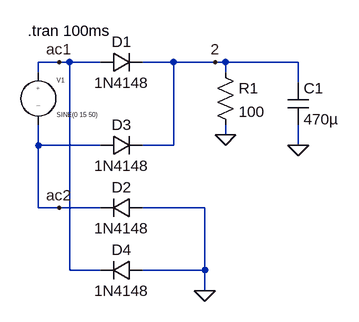
[diagram p0: schematic brueckengleichrichter.asc]
brueckengleichrichter.asc, the LTspice schematic file:
Version 4
SHEET 1 880 680
WIRE 96 112 64 112
WIRE 112 112 96 112
WIRE 160 112 112 112
WIRE 272 112 224 112
WIRE 336 112 272 112
WIRE 352 112 336 112
WIRE 464 112 352 112
WIRE 64 128 64 112
WIRE 352 128 352 112
WIRE 464 144 464 112
WIRE 352 224 352 208
WIRE 64 240 64 208
WIRE 160 240 64 240
WIRE 272 240 272 112
WIRE 272 240 224 240
WIRE 464 240 464 208
WIRE 64 336 64 240
WIRE 96 336 64 336
WIRE 160 336 96 336
WIRE 320 336 224 336
WIRE 112 432 112 112
WIRE 160 432 112 432
WIRE 320 432 320 336
WIRE 320 432 224 432
WIRE 320 464 320 432
FLAG 352 224 0
FLAG 336 112 2
FLAG 96 112 ac1
FLAG 96 336 ac2
FLAG 320 464 0
FLAG 464 240 0
SYMBOL diode 160 128 R270
WINDOW 0 32 32 VTop 2
WINDOW 3 0 32 VBottom 2
SYMATTR InstName D1
SYMATTR Value 1N4148
SYMBOL res 336 112 R0
SYMATTR InstName R1
SYMATTR Value 100
SYMBOL source-V 64 112 R0
WINDOW 123 0 0 Left 2
WINDOW 39 0 0 Left 2
SYMATTR InstName V1
SYMATTR Value SINE(0 15 50)
SYMBOL diode 224 320 R90
WINDOW 0 0 32 VBottom 2
WINDOW 3 32 32 VTop 2
SYMATTR InstName D2
SYMATTR Value 1N4148
SYMBOL diode 160 256 R270
WINDOW 0 32 32 VTop 2
WINDOW 3 0 32 VBottom 2
SYMATTR InstName D3
SYMATTR Value 1N4148
SYMBOL diode 224 416 R90
WINDOW 0 0 32 VBottom 2
WINDOW 3 32 32 VTop 2
SYMATTR InstName D4
SYMATTR Value 1N4148
SYMBOL cap 448 144 R0
SYMATTR InstName C1
SYMATTR Value 470µ
TEXT 48 64 Left 2 !.tran 100ms

The netlist it stands for:
* brueckengleichrichter.asc
D1 ac1 2 1N4148
R1 2 0 100
V1 ac1 ac2 SINE(0 15 50)
D2 0 ac2 1N4148
D3 ac2 2 1N4148
D4 0 ac1 1N4148
C1 2 0 470µ
.model D D
.lib standard.dio
.tran 100ms
.backanno
.end